# Altium schematic sheet Connector.SchDoc
size A4; SheetNumber: 2; SheetTotal: 2
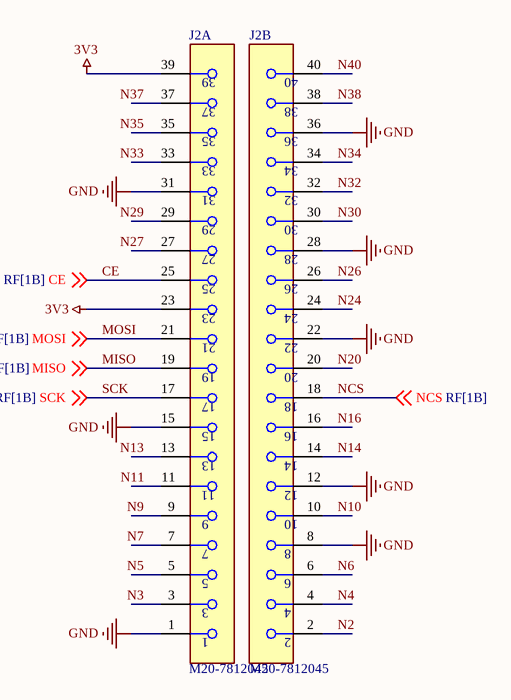
[diagram p0: Connector.SchDoc]

## Parts
J2  M20-7812045  [FP-M20-7812045-MFG]  (parts A,B of 2)  (no BOM)

## Nets
3V3: J2.23 J2.39
GND: J2.1 J2.8 J2.12 J2.15 J2.22 J2.28 J2.31 J2.36
CE: J2.25 ; off-sheet CE
MISO: J2.19 ; off-sheet MISO
MOSI: J2.21 ; off-sheet MOSI
N2: J2.2
N3: J2.3
N4: J2.4
N5: J2.5
N6: J2.6
N7: J2.7
N9: J2.9
N10: J2.10
N11: J2.11
N13: J2.13
N14: J2.14
N16: J2.16
N20: J2.20
N24: J2.24
N26: J2.26
N27: J2.27
N29: J2.29
N30: J2.30
N32: J2.32
N33: J2.33
N34: J2.34
N35: J2.35
N37: J2.37
N38: J2.38
N40: J2.40
NCS: J2.18 ; off-sheet NCS
SCK: J2.17 ; off-sheet SCK

## Library data of the parts
J2 = CMP-15831-000026-1: CONN RCPT 40POS 0.1 GOLD SMD; Current Rating: 3A; Number of Positions: 40; Connector Type: Receptacle; Max Operating Temperature: 105°C; Flammability Rating: UL94 V-0; Contact Material: Bronze; Number of Rows: 2; Fastening Type: Push; Insulation Color: Black; Mount: Surface Mount; Contact Shape: Square; Termination: Solder; Packaging: Rail/Tube; Contact Plating: Gold; Min Operating Temperature: -40°C; Insulation Material: Nylon